# EasyEDA schematic 4x4 Keypad.json
TITLE: Keypad 4x4 Pro Micro Backer; REV: 1.0; Date: 2021-02-05; Sheet: 1/1; Drawn By: daedalas1981; Company: R. Cole
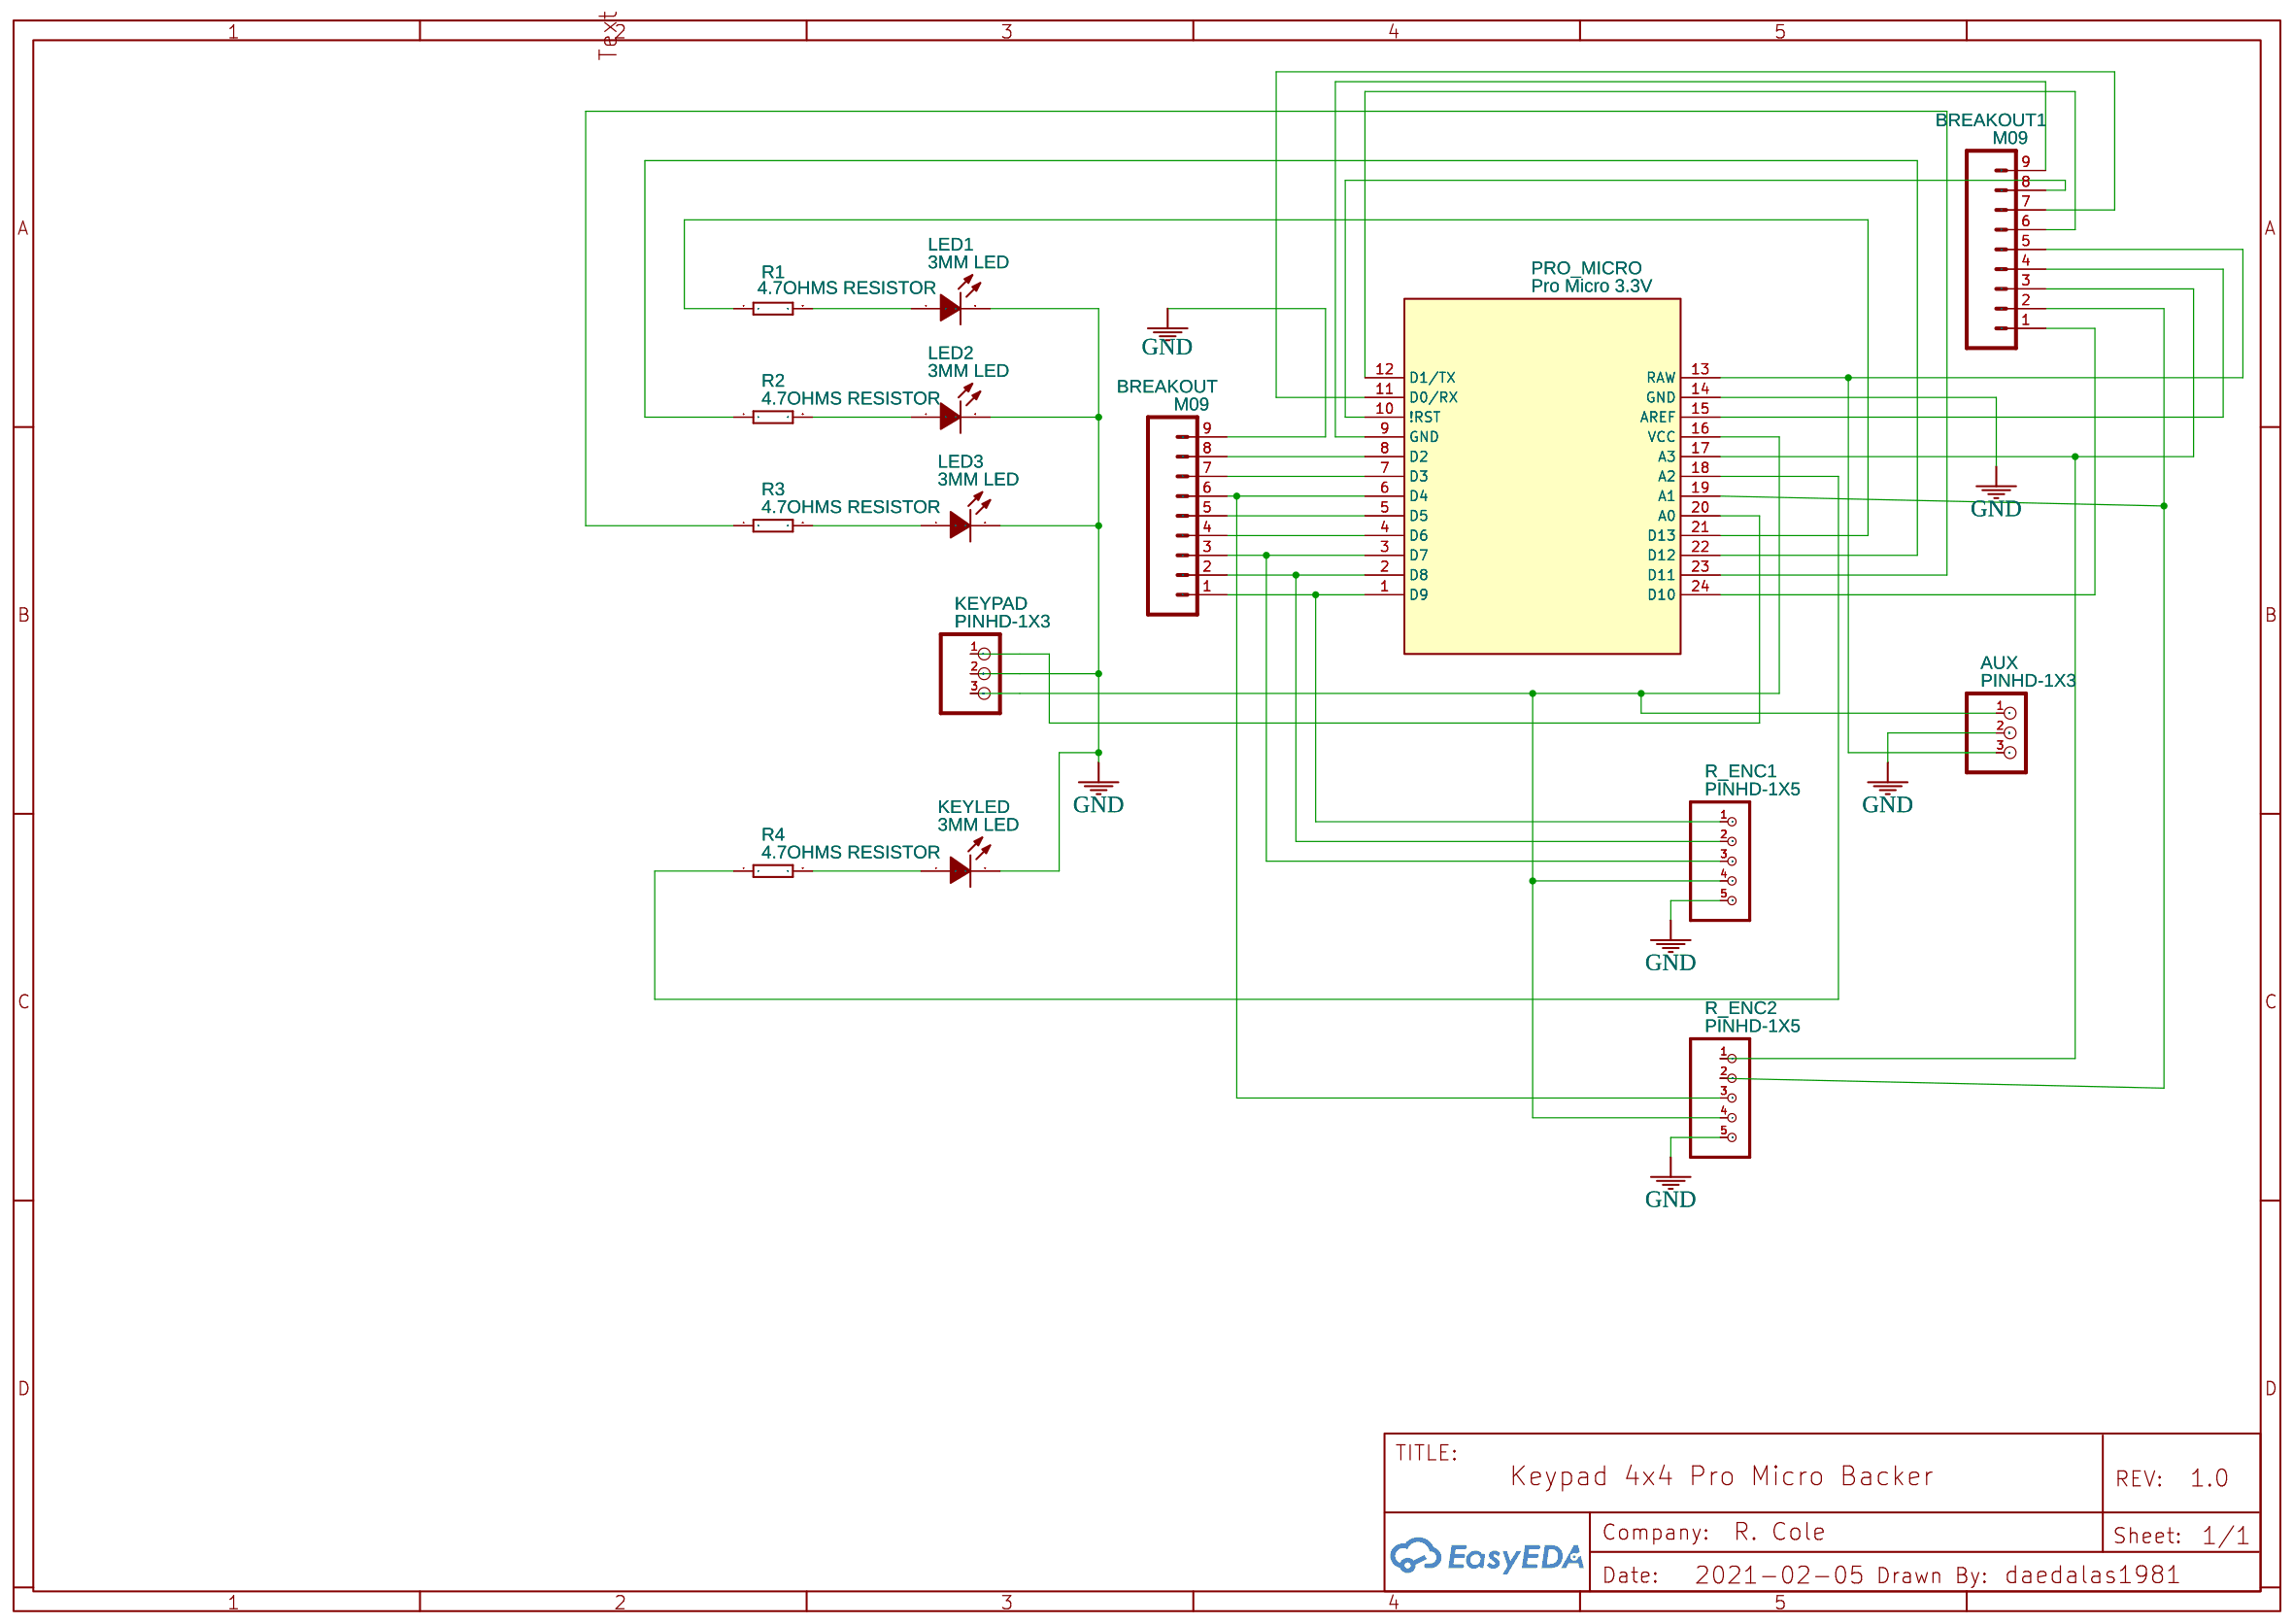
[diagram p0: schematic sheet]

## Parts
AUX  PINHD-1X3  [1X03]
BREAKOUT  M09  [1X09_LONGPADS]
BREAKOUT1  M09  [1X09_LONGPADS]
KEYLED  3MM LED  [LED-3MM]
KEYPAD  PINHD-1X3  [1X03]
LED1  3MM LED  [LED-3MM]
LED2  3MM LED  [LED-3MM]
LED3  3MM LED  [LED-3MM]
PRO_MICRO  Pro Micro 3.3V  [PRO MICRO 3.3V]
R1  4.7OHMS RESISTOR  [RTH025W]
R2  4.7OHMS RESISTOR  [RTH025W]
R3  4.7OHMS RESISTOR  [RTH025W]
R4  4.7OHMS RESISTOR  [RTH025W]
R_ENC1  PINHD-1X5  [1X05]
R_ENC2  PINHD-1X5  [1X05]

## Library data of the parts
AUX KEYPAD = PINHD-1X3: Contributor: Adafruit
BREAKOUT BREAKOUT1 = M09: Contributor: SparkFun
KEYLED LED1-LED3 = 3MM LED: Supplier: LCSC; Manufacturer: KENTO; Manufacturer Part: 3ARB9HCB; image: //image.lceda.cn/szlcsc/C42016.jpg; Supplier Part: C42016
PRO_MICRO = Pro Micro 3.3V: sourceId: UbZz96Gge; Supplier Part: 12587; Supplier: SparkFun
R1-R4 = RESISTOR: Contributor: DangerousPrototype
R_ENC1 R_ENC2 = PINHD-1X5: Contributor: alkronos

## Nets
GND: AUX.2(GND) BREAKOUT.9 KEYLED.2(K) KEYPAD.2(GND) LED1.2(K) LED2.2(K) LED3.2(K) PRO_MICRO.14(GND) R_ENC1.5 R_ENC2.5
Net-(AUX-1): AUX.1(VCC) KEYPAD.3(VCC) PRO_MICRO.16(VCC) R_ENC1.4 R_ENC2.4
Net-(AUX-3): AUX.3(RAW) BREAKOUT1.5 PRO_MICRO.13(RAW)
Net-(BREAKOUT1-1): BREAKOUT1.1 PRO_MICRO.24(D10)
Net-(BREAKOUT1-2): BREAKOUT1.2 PRO_MICRO.19(A1) R_ENC2.2
Net-(BREAKOUT1-3): BREAKOUT1.3 PRO_MICRO.17(A3) R_ENC2.1
Net-(BREAKOUT1-4): BREAKOUT1.4 PRO_MICRO.15(AREF)
Net-(BREAKOUT1-6): BREAKOUT1.6 PRO_MICRO.12(D1/TX)
Net-(BREAKOUT1-7): BREAKOUT1.7 PRO_MICRO.11(D0/RX)
Net-(BREAKOUT1-8): BREAKOUT1.8 PRO_MICRO.10(!RST)
Net-(BREAKOUT1-9): BREAKOUT1.9 PRO_MICRO.9(GND)
Net-(BREAKOUT-1): BREAKOUT.1 PRO_MICRO.1(D9) R_ENC1.1
Net-(BREAKOUT-2): BREAKOUT.2 PRO_MICRO.2(D8) R_ENC1.2
Net-(BREAKOUT-3): BREAKOUT.3 PRO_MICRO.3(D7) R_ENC1.3
Net-(BREAKOUT-4): BREAKOUT.4 PRO_MICRO.4(D6)
Net-(BREAKOUT-5): BREAKOUT.5 PRO_MICRO.5(D5)
Net-(BREAKOUT-6): BREAKOUT.6 PRO_MICRO.6(D4) R_ENC2.3
Net-(BREAKOUT-7): BREAKOUT.7 PRO_MICRO.7(D3)
Net-(BREAKOUT-8): BREAKOUT.8 PRO_MICRO.8(D2)
Net-(KEYLED-1): KEYLED.1(A) R4.2
Net-(KEYPAD-1): KEYPAD.1(AIN) PRO_MICRO.20(A0)
Net-(LED1-1): LED1.1(A) R1.2
Net-(LED2-1): LED2.1(A) R2.2
Net-(LED3-1): LED3.1(A) R3.2
Net-(PRO_MICRO-18): PRO_MICRO.18(A2) R4.1
Net-(PRO_MICRO-21): PRO_MICRO.21(D13) R1.1
Net-(PRO_MICRO-22): PRO_MICRO.22(D12) R2.1
Net-(PRO_MICRO-23): PRO_MICRO.23(D11) R3.1
